# Altium schematic sheet ESP_Grow_Main_V2_2_Pump_NeoPixel.SchDoc: Pump_Neopixel
size A; Date: 06/02/2019; Author: Kyle R.; Revision: A; SheetNumber: 2; SheetTotal: 5
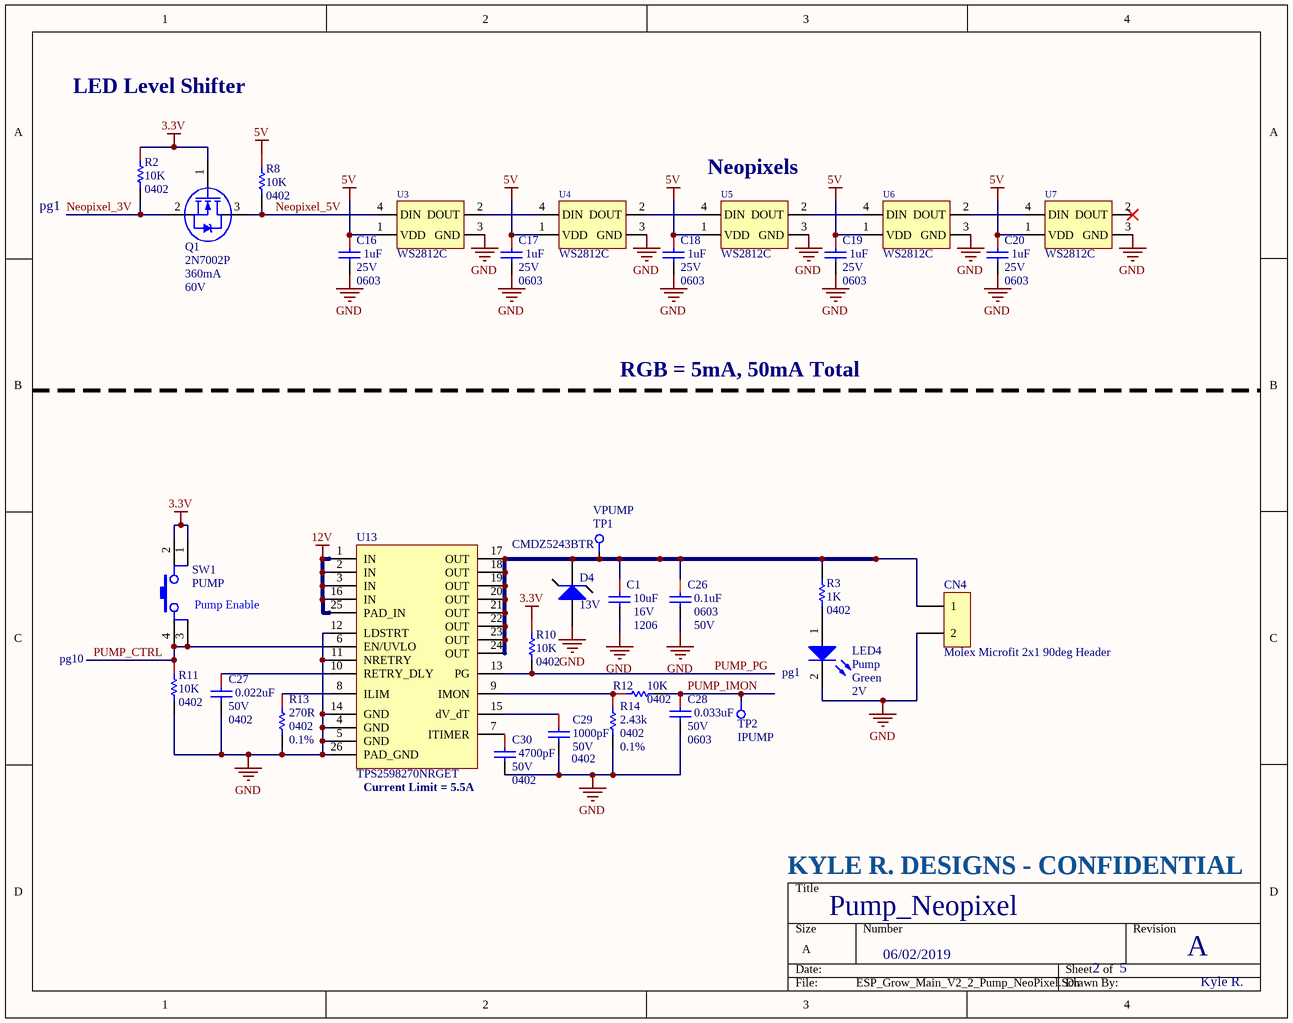
[diagram p0: ESP_Grow_Main_V2_2_Pump_NeoPixel.SchDoc]

## Parts
C1  10uF  Voltage - Rated: 16V  Package: 1206  [CAPC1206(3216)_M]
C16  1uF  Voltage - Rated: 25V  Package / Case: 0603  [CAPC0603(1608)_N]
C17  1uF  Voltage - Rated: 25V  Package / Case: 0603  [CAPC0603(1608)_N]
C18  1uF  Voltage - Rated: 25V  Package / Case: 0603  [CAPC0603(1608)_N]
C19  1uF  Voltage - Rated: 25V  Package / Case: 0603  [CAPC0603(1608)_N]
C20  1uF  Voltage - Rated: 25V  Package / Case: 0603  [CAPC0603(1608)_N]
C26  Package / Case: 0603  Voltage - Rated: 50V  [CAPC0603(1608)_L]  (hidden comment: 0.1uF)
C27  0.022uF  Voltage (Rated): 50V  Package (Imperial): 0402  [CAPC0402(1005)_N]
C28  0.033uF  Voltage (Rated): 50V  Package (Imperial): 0603  [CAPC0603(1608)_L]
C29  Voltage - Rated: 50V  Package / Case: 0402  [CAPC0402(1005)_N]  (hidden comment: 1000pF)
C30  4700pF  Voltage (Rated): 50V  Package (Imperial): 0402  [CAPC0402(1005)_L]
CN4  Molex Microfit 2x1 90deg Header  [Molex 2x1 Microfit 90deg]
D4  CMDZ5243BTR  Zener Voltage: 13V  [SOD-323]
LED4  Pump  Color: Green  Voltage - Forward (Vf) (Typ): 2V  [SM-LED-0603]
Q1  2N7002P  Continuous Drain Current (ID): 360mA  Drain to Source Voltage (Vdss): 60V  [SOT23]
R2  Resistance: 10K  Package: 0402  [RESC0402(1005)_N]  (hidden comment: 0402WGF1002TCE)
R3  Package / Case: 0402  [RESC0402(1005)_L]  (hidden comment: 1K)
R8  Resistance: 10K  Package: 0402  [RESC0402(1005)_N]  (hidden comment: 0402WGF1002TCE)
R10  Resistance: 10K  Package: 0402  [RESC0402(1005)_N]  (hidden comment: 0402WGF1002TCE)
R11  Resistance: 10K  Package: 0402  [RESC0402(1005)_N]  (hidden comment: 0402WGF1002TCE)
R12  Resistance: 10K  Package: 0402  [RESC0402(1005)_N]  (hidden comment: 0402WGF1002TCE)
R13  Tolerance: 0.1%  Resistance: 270R  Case Code (Imperial): 0402  [RESC0402(1005)_N]  (hidden comment: 270)
R14  Tolerance: 0.1%  Case/Package: 0402  Resistance: 2.43k  [RESC0402(1005)_L]  (hidden comment: 2.34k)
SW1  PUMP  [SW TACT Red 6mm x 6mm]
TP1  VPUMP  [Pogo-Testpoint]  (no BOM)
TP2  IPUMP  [Pogo-Testpoint]  (no BOM)
U3  WS2812C  [WS2812C]
U4  WS2812C  [WS2812C]
U5  WS2812C  [WS2812C]
U6  WS2812C  [WS2812C]
U7  WS2812C  [WS2812C]
U13  TPS2598270NRGET  [VQFN_24]

## Nets
3.3V: Q1.1(G) R2.1 R10.1 SW1.1 SW1.2
5V: C16.1 C17.1 C18.1 C19.1 C20.1 R8.1 U3.1(VDD) U4.1(VDD) U5.1(VDD) U6.1(VDD) U7.1(VDD)
12V: U13.1(IN) U13.2(IN) U13.3(IN) U13.16(IN) U13.25(PAD_IN)
GND: C1.2 C16.2 C17.2 C18.2 C19.2 C20.2 C26.2 C27.2 C28.2 C29.2 C30.2 CN4.2 D4.2(A) LED4.2(K) R11.2 R13.2 R14.2 U3.3(GND) U4.3(GND) U5.3(GND) U6.3(GND) U7.3(GND) U13.4(GND) U13.5(GND) U13.11(NRETRY) U13.12(LDSTRT) U13.14(GND) U13.26(PAD_GND)
Neopixel_3V: Q1.2(S) R2.2
Neopixel_5V: Q1.3(D) R8.2 U3.4(DIN)
PUMP_CTRL: R11.1 SW1.3 SW1.4 U13.6(EN/UVLO)
PUMP_IMON: C28.1 R12.2 TP2.1
PUMP_PG: R10.2 U13.13(PG)
NetC1_1: C1.1 C26.1 CN4.1 D4.1(K) R3.2 TP1.1 U13.17(OUT) U13.18(OUT) U13.19(OUT) U13.20(OUT) U13.21(OUT) U13.22(OUT) U13.23(OUT) U13.24(OUT)
NetC27_1: C27.1 U13.10(RETRY_DLY)
NetC29_1: C29.1 U13.15(dV_dT)
NetC30_1: C30.1 U13.7(ITIMER)
NetLED4_1: LED4.1(A) R3.1
NetR12_1: R12.1 R14.1 U13.9(IMON)
NetR13_1: R13.1 U13.8(ILIM)
NetU3_2: U3.2(DOUT) U4.4(DIN)
NetU4_2: U4.2(DOUT) U5.4(DIN)
NetU5_2: U5.2(DOUT) U6.4(DIN)
NetU6_2: U6.2(DOUT) U7.4(DIN)

Not connected (* = marked no-connect by the designer): U7 2(DOUT)*

## Notes on the sheet
- LED Level Shifter
- pg1
- (near U5) Neopixels
- RGB = 5mA, 50mA Total
- (near SW1) Pump Enable
- pg10
- (near LED4) pg1
- Current Limit = 5.5A
- KYLE R. DESIGNS - CONFIDENTIAL

## Library data of the parts
C1 = CAP CER 10UF 16V 1206: Temperature Coefficient: X7R; LCSC: C126600; Capacitance: 10uF; Supplier 1: Digi-Key; Supplier Part Number 1: 490-4793-1-ND
C16-C20 = CAP CER 1UF 25V 10% X7R 0603: 1uF 0603 25V; Manufacturer: TDK Corporation; Manufacturer Part Number: CGA3E1X7R1E105K080AC; Tolerance: ±10%; Temperature Coefficient: X7R; Supplier 1: Digi-Key; RoHS: RoHS Compliant; Category: Capacitors; Stock 1: 360610; Pricing 1: 1=0.2, 10=0.135, 100=0.0686, 500=0.04696, 1000=0.04154 (USD); Packaging: Cut Tape (CT); Part Status: Active; Operating Temperature: -55°C ~ 125°C; Features: -; Ratings: AEC-Q200; Applications: Automotive; Failure Rate: -; Mounting Type: Surface Mount, MLCC; Size / Dimension: 0.063" L x 0.032" W (1.60mm x 0.80mm); Height - Seated (Max): -; Thickness (Max): 0.035" (0.90mm); Lead Spacing: -; Lead Style: -; ComponentLink1URL: https://product.tdk.com/info/en/catalog/datasheets/mlcc_automotive_general_en.pdf; ComponentLink1Description: https://product.tdk.com/info/en/catalog/datasheets/mlcc_automotive_general_en.pdf; Supplier Part Number 1: 445-6931-1-ND
C26 = 0.1uF_0603: 100NF 50V 0603; Manufacturer: YAGEO; Manufacturer Part Number: CC0603KRX7R9BB104; Tolerance: ±10%; Temperature Coefficient: X7R; Supplier 1: Digi-Key; RoHS: RoHS Compliant; Category: Capacitors; Stock 1: 2360000; Pricing 1: 4000=0.00414, 8000=0.00378, 12000=0.0036, 28000=0.00342, 100000=0.00248 (USD); Packaging: Tape & Reel (TR); Mounting Type: Surface Mount, MLCC; Operating Temperature: -55°C ~ 125°C; Applications: General Purpose; Ratings: -; Size / Dimension: 0.063" L x 0.031" W (1.60mm x 0.80mm); Height - Seated (Max): -; Thickness (Max): 0.034" (0.87mm); Lead Spacing: -; Features: -; Lead Style: -; ComponentLink1URL: http://www.kemet.com/datasheets&C0603C104K4RACTU; ComponentLink1Description: http://www.kemet.com/datasheets&C0603C104K4RACTU; Supplier Part Number 1: 399-1096-2-ND; ComponentLink2Description: New link; ComponentLink2URL: *; LCSC Part #: C14663; Capacitance: 0.1uF
C27 = CMP-007-0030-08: CAP CER 0.022UF 50V X7R 0402; Tolerance: 10%; Package (Metric): 1005; Capacitance: 22nF; Dielectric Material: Ceramic; Temperature Coefficient: X7R; Mounting Type: SMD
C28 = CMP-007-0033-08: CAP CER 0.033UF 50V X7R 0603; Tolerance: 5%; Package (Metric): 1608; Dielectric Material: Ceramic; Capacitance: 33nF; Temperature Coefficient: X7R; Mounting Type: SMD
C29 = CAP CER 1000PF 50V C0G/NP0 0402: 1000pF 50V C0G 0402 Kemet 2017; Manufacturer Part Number: C0402C102J5GACTU; Tolerance: ±5%; Temperature Coefficient: C0G, NP0; Supplier 1: Digi-Key; Manufacturer: KEMET; RoHS: RoHS Compliant; Category: Capacitors; Stock 1: 1400284; Pricing 1: 1=0.1, 10=0.07, 100=0.031, 500=0.02214, 1000=0.01739, 2500=0.01581, 5000=0.01455 (USD); Packaging: Cut Tape (CT); Part Status: Active; Operating Temperature: -55°C ~ 125°C; Features: Low ESL; Ratings: -; Applications: General Purpose; Failure Rate: -; Mounting Type: Surface Mount, MLCC; Size / Dimension: 0.039" L x 0.020" W (1.00mm x 0.50mm); Height - Seated (Max): -; Thickness (Max): 0.022" (0.55mm); Lead Spacing: -; Lead Style: -; Supplier Part Number 1: 399-10034-1-ND; Capacitance: 1000pF
C30 = CMP-007-0152-08: CAP CER 4700PF 50V X7R 0402; Dielectric Material: Ceramic; Package (Metric): 1005; Tolerance: 10%; Capacitance: 4.7nF; Mounting Type: SMD; Temperature Coefficient: X7R
CN4 = MICROFIT 3.0 HDR 90deg 2x1CKT: Manufacturer: Molex Inc; Manufacturer Part Number: 0430450200; Connector Type: Header, Shrouded; Number of Positions: 2; Number of Positions Loaded: All; Pitch: 0.118" (3.00mm); ClassName: *; Supplier 1: Digi-Key; RoHS: RoHS Compliant; Category: Connectors, Interconnects; Stock 1: 5243; Pricing 1: 1=0.92, 10=0.809, 50=0.7298, 100=0.6981, 250=0.6346, 500=0.57114, 1000=0.50768, 2500=0.46008, 5000=0.44422 (USD); Packaging: Tray; Contact Type: Male Pin; Number of Rows: 2; Row Spacing: 0.118" (3.00mm); Contact Mating Length: -; Mounting Type: Through Hole, Right Angle; Termination: Solder; Fastening Type: Locking Ramp; Features: Board Lock; Contact Finish: Tin; Contact Finish Thickness: 100µin (2.54µm); Color: Black; ComponentLink1URL: http://www.molex.com/pdm_docs/sd/430450200_sd.pdf; ComponentLink1Description: http://www.molex.com/pdm_docs/sd/430450200_sd.pdf; Supplier Part Number 1: WM1813-ND
D4 = CMP-001-0939-01: DIODE ZENER 13V 250MW SOD323; Tolerance: 5%; Impedance: 13R; Max Operating Temperature: 150°C; Max Power Dissipation: 250mW; Packaging: Tape and Reel; Min Operating Temperature: -65°C; Mount: Surface Mount
LED4 = CMP-001-0086-06: LED GREEN CLEAR THIN 0603 SMD; Manufacturer Part Number: LTST-C191KGKT; Manufacturer: Lite-On Inc; Millicandela Rating: 35mcd; Wavelength - Peak: 574nm; Current - Test: 20mA; Wavelength - Dominant: 571nm; Viewing Angle: 130°; Lens Style/Size: Rectangle with Flat Top, 1.1mm x 0.8mm; Size / Dimension: 1.60mm L x 0.80mm W; Mounting Type: Surface Mount; Designator: LTST-C191KGKT; Height: 0.55mm; RoHS: RoHS Compliant; Package / Case: 0603 (1608 Metric); Packaging: Cut Tape (CT); Lens Type: Clear; Pin Count: 2; Stock 1: 84829; Pricing 1: 1=0.3, 10=0.238, 100=0.1296, 250=0.0864, 500=0.07344, 1000=0.05616, 2500=0.05076 (USD); ClassName: *
Q1 = CMP-012-0002-05: MOSFET N-CH 60V 0.36A SOT-23; Drain to Source Resistance: 1.6R; Gate to Source Voltage (Vgs): 20V; Turn-Off Delay Time: 10ns; Input Capacitance: 50pF; Max Power Dissipation: 350mW; Rise Time: 4ns; Fall Time: 5ns; Number of Elements: 1; Power Dissipation: 420mW; Turn-On Delay Time: 3ns; Contact Plating: Tin; Case/Package: SOT; Number of Pins: 3; Rds On Max: 1.6R; Package Quantity: 10000; Lead Free: Lead Free; Packaging: Tape and Reel; Max Dual Supply Voltage: 60V; Min Operating Temperature: -55°C; Radiation Hardening: No; Drain to Source Breakdown Voltage: 60V; Max Operating Temperature: 150°C
R2 R8 R10-R12 = 10k_0402: 10KOHMS ±1% 1/10W 0402; Supplier Part Number 1: C25744; Manufacturer Part Number 1: 0402WGF1002TCE; Supplier 1: LCSC
R3 = RES 1K OHM 1% 1/16W 0402: 1K 0402; Manufacturer: Yageo; Manufacturer Part Number: RC0402FR-071KL; Tolerance: 1%; Temperature Coefficient: 100ppm/°C; Power Rating: 62.5mW; Voltage Rating: 50V; ComponentLink1URL: https://datasheet.ciiva.com/2453/pyu-r-int-thick-7-2453361.pdf; ComponentLink1Description: https://datasheet.ciiva.com/2453/pyu-r-int-thick-7-2453361.pdf; ComponentLink2URL: https://datasheet.ciiva.com/2453/pyu-r-int-thick-7-2453362.pdf; ComponentLink2Description: https://datasheet.ciiva.com/2453/pyu-r-int-thick-7-2453362.pdf; ComponentLink3URL: https://datasheet.ciiva.com/2453/pyu-r-int-thick-7-2453363.pdf; ComponentLink3Description: https://datasheet.ciiva.com/2453/pyu-r-int-thick-7-2453363.pdf; ComponentLink4URL: https://datasheet.ciiva.com/22747/1018594-22747509.pdf; ComponentLink4Description: https://datasheet.ciiva.com/22747/1018594-22747509.pdf; ComponentLink5URL: https://datasheet.ciiva.com/15189/getdatasheetpartid-323696-15189334.pdf; ComponentLink5Description: https://datasheet.ciiva.com/15189/getdatasheetpartid-323696-15189334.pdf; ComponentLink6URL: https://datasheet.ciiva.com/16740/pyu-rc0402-51-rohs-l-6-r-16740567.pdf; ComponentLink6Description: https://datasheet.ciiva.com/16740/pyu-rc0402-51-rohs-l-6-r-16740567.pdf; ComponentLink7URL: https://datasheet.ciiva.com/12667/pyu-rc0402-51-rohs-l-6-r-12667930.pdf; ComponentLink7Description: https://datasheet.ciiva.com/12667/pyu-rc0402-51-rohs-l-6-r-12667930.pdf; ComponentLink8URL: https://datasheet.ciiva.com/11819/0900766b80c66297-11819452.pdf; ComponentLink8Description: https://datasheet.ciiva.com/11819/0900766b80c66297-11819452.pdf; Supplier 1: Digi-Key; Supplier Part Number 1: 311-1.00KLRCT-ND; Stock 1: 21888659; Pricing 1: 1=0.1, 10=0.014, 100=0.0056, 1000=0.0025, 2500=0.0022, 5000=0.0018 (USD); Case/Package: 0402; Number of Pins: 2; Case Code (Imperial): 0402; Case Code (Metric): 1005; Min Operating Temperature: -55°C; Max Operating Temperature: 155°C; Packaging: Tape and Reel; Composition: Thick Film; Voltage Rating (DC): 50V; Termination: SMD/SMT; Military Standard: Not; Length: 1mm; Height: 0.32mm; Width: 0.5mm; Depth: 0.5mm; REACH SVHC: Unknown; Lead Free: Lead Free; ComponentLink9URL: https://datasheet.ciiva.com/11819/0900766b80c66297-11819477.pdf; ComponentLink9Description: https://datasheet.ciiva.com/11819/0900766b80c66297-11819477.pdf; ComponentLink10URL: https://datasheet.ciiva.com/12666/pyu-rc0402-51-rohs-l-6-r-12666741.pdf; ComponentLink10Description: https://datasheet.ciiva.com/12666/pyu-rc0402-51-rohs-l-6-r-12666741.pdf; ComponentLink11URL: https://datasheet.ciiva.com/17063/pyu-rc0402-51-rohs-l-6-r-17063193.pdf; ComponentLink11Description: https://datasheet.ciiva.com/17063/pyu-rc0402-51-rohs-l-6-r-17063193.pdf; ComponentLink12URL: https://datasheet.ciiva.com/22747/1018594-22747513.pdf; ComponentLink12Description: https://datasheet.ciiva.com/22747/1018594-22747513.pdf; ComponentLink13URL: https://datasheet.ciiva.com/7849/1018594-7849869.pdf; ComponentLink13Description: https://datasheet.ciiva.com/7849/1018594-7849869.pdf; ComponentLink14URL: https://datasheet.ciiva.com/7983/1018594-7983502.pdf; ComponentLink14Description: https://datasheet.ciiva.com/7983/1018594-7983502.pdf; ComponentLink15URL: https://datasheet.ciiva.com/7849/1018594-7849871.pdf; ComponentLink15Description: https://datasheet.ciiva.com/7849/1018594-7849871.pdf; Category: Resistors; Resistance: 1K
R13 = CMP-001-1332-01: RES SMD 270 OHM 0.1% 1/16W 0402; Power Rating: 30mW; Temperature Coefficient: 25ppm/°C; Voltage Rating (DC): 25V; Package Quantity: 5000; Min Operating Temperature: -55°C; Termination: SMD/SMT; Resistor Type: Thin Film; Lead Free: Lead Free; Max Operating Temperature: 155°C; Height: 0.35mm; REACH SVHC: Unknown; Width: 0.5mm; Length: 1mm; Voltage Rating: 25V; Number of Pins: 2; Case/Package: 0402; Packaging: Tape and Reel; Case Code (Metric): 1005
R14 = CMP-001-1331-01: RES SMD 2.43KOHM 0.1% 1/16W 0402; Voltage Rating (DC): 50V; Power Rating: 63mW; Temperature Coefficient: 25ppm/°C; Voltage Rating: 25V; Case Code (Metric): 1005; Max Operating Temperature: 155°C; Number of Terminations: 2; Package Quantity: 1; Length: 0.039inch; Width: 0.02inch; Features: Automotive AEC-Q200; Lead Free: Lead Free; Weight: 2.8E-05oz; Termination: SMD/SMT; Min Operating Temperature: -55°C; Case Code (Imperial): 0402; Max Power Dissipation: 63mW; Resistor Type: Thin Film,Metal Film; Height: 0.016inch; Mount: Surface Mount; REACH SVHC: Unknown; Packaging: Tape and Reel
SW1 = PTS645SM43SMTR92 LFS: SWITCH TACTILE SPST-NO 0.05A 12V; Manufacturer: C&K; Switch Function: Off-Mom; Contact Rating @ Voltage: 0.05A @ 12VDC; Actuator Type: Standard; Actuator Height off PCB, Vertical: 4.30mm; Actuator Orientation: Top Actuated; Outline: 6.00mm x 6.00mm; Illumination: Non-Illuminated; Operating Force: 160gf; Actuator Material: Polyamide (PA66), Nylon 6/6; Mechanical Life: 100,000 Cycles; ClassName: *; Supplier 1: Digi-Key; Manufacturer Part Number: PTS645SM43SMTR92 LFS; RoHS: RoHS Compliant; Category: Switches; Stock 1: 234699; Pricing 1: 1=0.15, 10=0.147, 25=0.1416, 50=0.1366, 100=0.129, 250=0.12144, 500=0.11638 (USD); Packaging: Cut Tape (CT); Part Status: Active; Circuit: SPST-NO; Mounting Type: Surface Mount; Actuator Length, Right Angle: -; Termination Style: Gull Wing; Illumination Type, Color: -; Illumination Voltage (Nominal): -; Ingress Protection: -; Features: Blue Actuator; Switch Travel: -; Operating Temperature: -20°C ~ 60°C; ComponentLink1URL: http://www.ckswitches.com/media/1471/pts645.pdf; ComponentLink1Description: http://www.ckswitches.com/media/1471/pts645.pdf; Supplier Part Number 1: CKN9112CT-ND
TP1 TP2 = CMP-001-0557-03: Test Point- Current one; Pin Count: 1; Component Name: TestPoint; Designator: TestPoint
U3-U7 = WS2812C: Serial RGB LED; RGB Current: 5mA; Voltage: 3.5V ~ 5.3V; RED Brightness: 60mcd; GREEN Brightness: 245mcd; BLUE Brightness: 65 mcd; White Brightness: 365 mcd; LCSC: C114587; Datasheet: https://datasheet.lcsc.com/szlcsc/Worldsemi-WS2812C_C114587.pdfhttps://datasheet.lcsc.com/szlcsc/Worldsemi-WS2812C_C114587.pdf
U13 = CMP-001-0746-09: 15A, 3mohm eFuse with Accurate Current Monitor and Configurable Retry Timers - No UV Lockout; Current Monitor Output: Accuracy: ±1% (Typical, for IOUT> 2 A); Output Slew Rate (dVdt): Adjustable; Fault Response: Auto-Retry; Over Temperature Protection: Yes; Voltage Input: 2.7 V to 24 V; Over Voltage Protection: N/A on this model; Extra Features: Programmable Load Handshake Timer; Current Limit Threshold: 3 A to 15 A; Rds on: 3-mΩ; Type: Circuit Breaker; Datasheet: https://www.ti.com/lit/gpn/TPS25982; Power Good Output: Yes; Supplier Link: https://www.ti.com/store/ti/en/p/product/?p=PTPS259827ONRGET; ComponentLink1Description: New link; ComponentLink1URL: *